# Altium project SWD-NEEDLE.PrjPcb
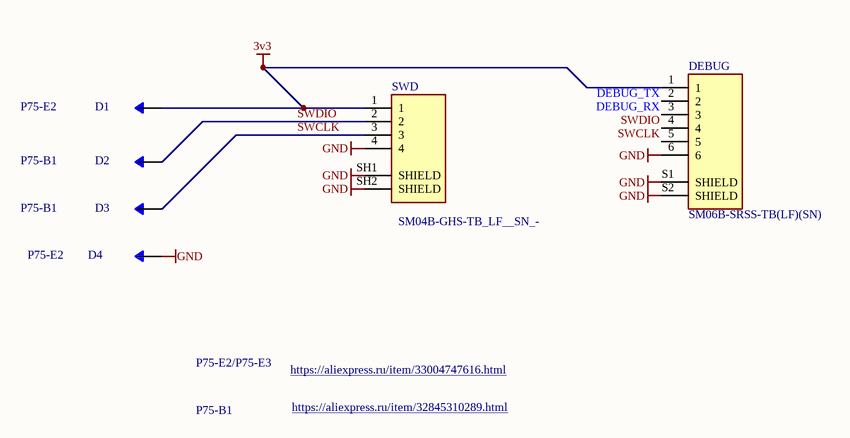
[diagram p0: SWD-NEEDLE.SchDoc]
Version: 1.1.0
1 sheet, 6 parts. Net scope: global (net labels, ports and power ports of the same name join across sheets).
Board file: PCB.PcbDoc

## Sheet SWD-NEEDLE.SchDoc
size A4; Revision: 1

### Parts
D1  P75-E2  [P75-E2]
D2  P75-B1  [P75-E2]
D3  P75-B1  [P75-E2]
D4  P75-E2  [P75-E2]
DEBUG  SM06B-SRSS-TB(LF)(SN)  [JST_SM06B-SRSS-TB(LF)(SN)]
SWD  MP: SM04B-GHS-TB_LF__SN_-  [JST_SM04B-GHS-TB(LF)(SN)-]

### Nets
3v3: D1.1 DEBUG.1 SWD.1
GND: D4.1 DEBUG.6 DEBUG.S1(SHIELD) DEBUG.S2(SHIELD) SWD.4 SWD.SH1(SHIELD) SWD.SH2(SHIELD)
DEBUG_RX: DEBUG.3
DEBUG_TX: DEBUG.2
SWCLK: D3.1 DEBUG.5 SWD.3
SWDIO: D2.1 DEBUG.4 SWD.2

### Notes on the sheet
- P75-E2/P75-E3
- https://aliexpress.ru/item/33004747616.html
- P75-B1
- https://aliexpress.ru/item/32845310289.html

### Library data of the parts
D1 D4 = Pogo pin P75-E2: MP: P75-B1; System: Connector; Instructions: see picture to install; Type: SMD
D2 D3 = Pogo pin P75-E2: Pogo pin P75-B1; System: Connector; Instructions: see picture to install; Type: SMD; MP: P75-B1
DEBUG = SM06B-SRSS-TB(LF)(SN): Connector Header Surface Mount, Right Angle 6 position 0.039 _1.00mm_; MP: SM06B-SRSS-TB_LF__SN_; MF: JST Sales; Package: None; Value: *; SnapEDA_Link: https://www.snapeda.com/parts/SM06B-SRSS-TB%28LF%29%28SN%29/JST%20Sales%20America%20Inc./view-part/554386/?ref=snap; Digi-Key_Purchase_URL: https://www.digikey.com/product-detail/en/jst-sales-america-inc/SM06B-SRSS-TB_LF__SN_/455-1806-1-ND/926877?utm_source=snapeda&utm_medium=aggregator&utm_campaign=symbol; Digi-Key_Part_Number: 455-1806-1-ND; System: Connector; Type: SMD
SWD = SM04B-GHS-TB(LF)(SN)-: Connector Header Surface Mount, Right Angle 4 position 0.049 _1.25mm_; MF: JST Sales; Availability: Unavailable; Package: None; Value: *; Price: None; SnapEDA_Link: https://www.snapeda.com/parts/SM04B-GHS-TB%28LF%29%28SN%29-/JST%20Sales%20America%20Inc./view-part/2759740/?ref=snap; HelpURL: http://www.farnell.com/datasheets/2082975.pdf; System: Connector; ChipDip_Link: https://www.chipdip.ru/product/sm04b-ghs-tb-lf-sn-gh-1.25mm-header-side-ent; Type: SMD